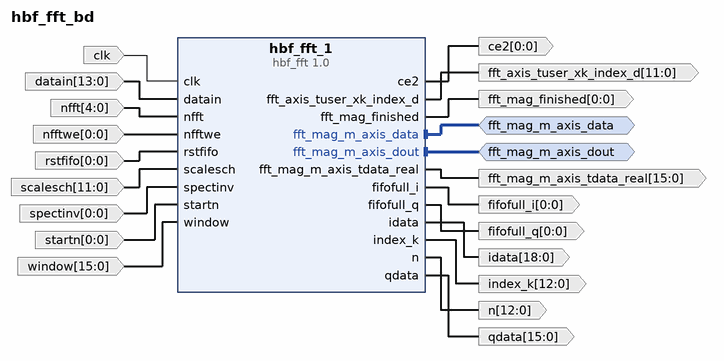
[diagram p0: block diagram of the top level]
# Vivado block design hbf_fft_bd, Vivado 2015.4
create_bd_design hbf_fft_bd

create_bd_intf_port -mode Master -vlnv xilinx.com:interface:axis_rtl:1.0 fft_mag_m_axis_data
create_bd_intf_port -mode Master -vlnv xilinx.com:interface:axis_rtl:1.0 fft_mag_m_axis_dout
create_bd_port -dir O -from 0 -to 0 -type data ce2
create_bd_port -dir I -type clk clk
create_bd_port -dir I -from 13 -to 0 -type data datain
create_bd_port -dir O -from 11 -to 0 -type data fft_axis_tuser_xk_index_d
create_bd_port -dir O -from 0 -to 0 -type data fft_mag_finished
create_bd_port -dir O -from 15 -to 0 -type data fft_mag_m_axis_tdata_real
create_bd_port -dir O -from 0 -to 0 -type data fifofull_i
create_bd_port -dir O -from 0 -to 0 -type data fifofull_q
create_bd_port -dir O -from 18 -to 0 -type data idata
create_bd_port -dir O -from 12 -to 0 -type data index_k
create_bd_port -dir O -from 12 -to 0 -type data n
create_bd_port -dir I -from 4 -to 0 -type data nfft
create_bd_port -dir I -from 0 -to 0 -type data nfftwe
create_bd_port -dir O -from 15 -to 0 -type data qdata
create_bd_port -dir I -from 0 -to 0 -type data rstfifo
create_bd_port -dir I -from 11 -to 0 -type data scalesch
create_bd_port -dir I -from 0 -to 0 -type data spectinv
create_bd_port -dir I -from 0 -to 0 -type data startn
create_bd_port -dir I -from 15 -to 0 -type data window

create_bd_cell -type ip -vlnv SEMCO:SysGen:hbf_fft:1.0 hbf_fft_1

# ---- connections ----

connect_bd_intf_net [get_bd_intf_ports fft_mag_m_axis_data] [get_bd_intf_pins hbf_fft_1/fft_mag_m_axis_data]
connect_bd_intf_net [get_bd_intf_ports fft_mag_m_axis_dout] [get_bd_intf_pins hbf_fft_1/fft_mag_m_axis_dout]
connect_bd_net [get_bd_pins hbf_fft_1/ce2] [get_bd_ports ce2]
connect_bd_net [get_bd_ports clk] [get_bd_pins hbf_fft_1/clk]
connect_bd_net [get_bd_ports datain] [get_bd_pins hbf_fft_1/datain]
connect_bd_net [get_bd_pins hbf_fft_1/fft_axis_tuser_xk_index_d] [get_bd_ports fft_axis_tuser_xk_index_d]
connect_bd_net [get_bd_pins hbf_fft_1/fft_mag_finished] [get_bd_ports fft_mag_finished]
connect_bd_net [get_bd_pins hbf_fft_1/fft_mag_m_axis_tdata_real] [get_bd_ports fft_mag_m_axis_tdata_real]
connect_bd_net [get_bd_pins hbf_fft_1/fifofull_i] [get_bd_ports fifofull_i]
connect_bd_net [get_bd_pins hbf_fft_1/fifofull_q] [get_bd_ports fifofull_q]
connect_bd_net [get_bd_pins hbf_fft_1/idata] [get_bd_ports idata]
connect_bd_net [get_bd_pins hbf_fft_1/index_k] [get_bd_ports index_k]
connect_bd_net [get_bd_pins hbf_fft_1/n] [get_bd_ports n]
connect_bd_net [get_bd_ports nfft] [get_bd_pins hbf_fft_1/nfft]
connect_bd_net [get_bd_ports nfftwe] [get_bd_pins hbf_fft_1/nfftwe]
connect_bd_net [get_bd_pins hbf_fft_1/qdata] [get_bd_ports qdata]
connect_bd_net [get_bd_ports rstfifo] [get_bd_pins hbf_fft_1/rstfifo]
connect_bd_net [get_bd_ports scalesch] [get_bd_pins hbf_fft_1/scalesch]
connect_bd_net [get_bd_ports spectinv] [get_bd_pins hbf_fft_1/spectinv]
connect_bd_net [get_bd_ports startn] [get_bd_pins hbf_fft_1/startn]
connect_bd_net [get_bd_ports window] [get_bd_pins hbf_fft_1/window]

validate_bd_design
save_bd_design
